# Altium schematic sheet Sky_Sheet.SchDoc: TotalSky
size A4; Author: Edwin Lima; CompanyName: Universidad de Cuenca; DrawnBy: Edwin Lima; SheetNumber: 1; SheetTotal: 5
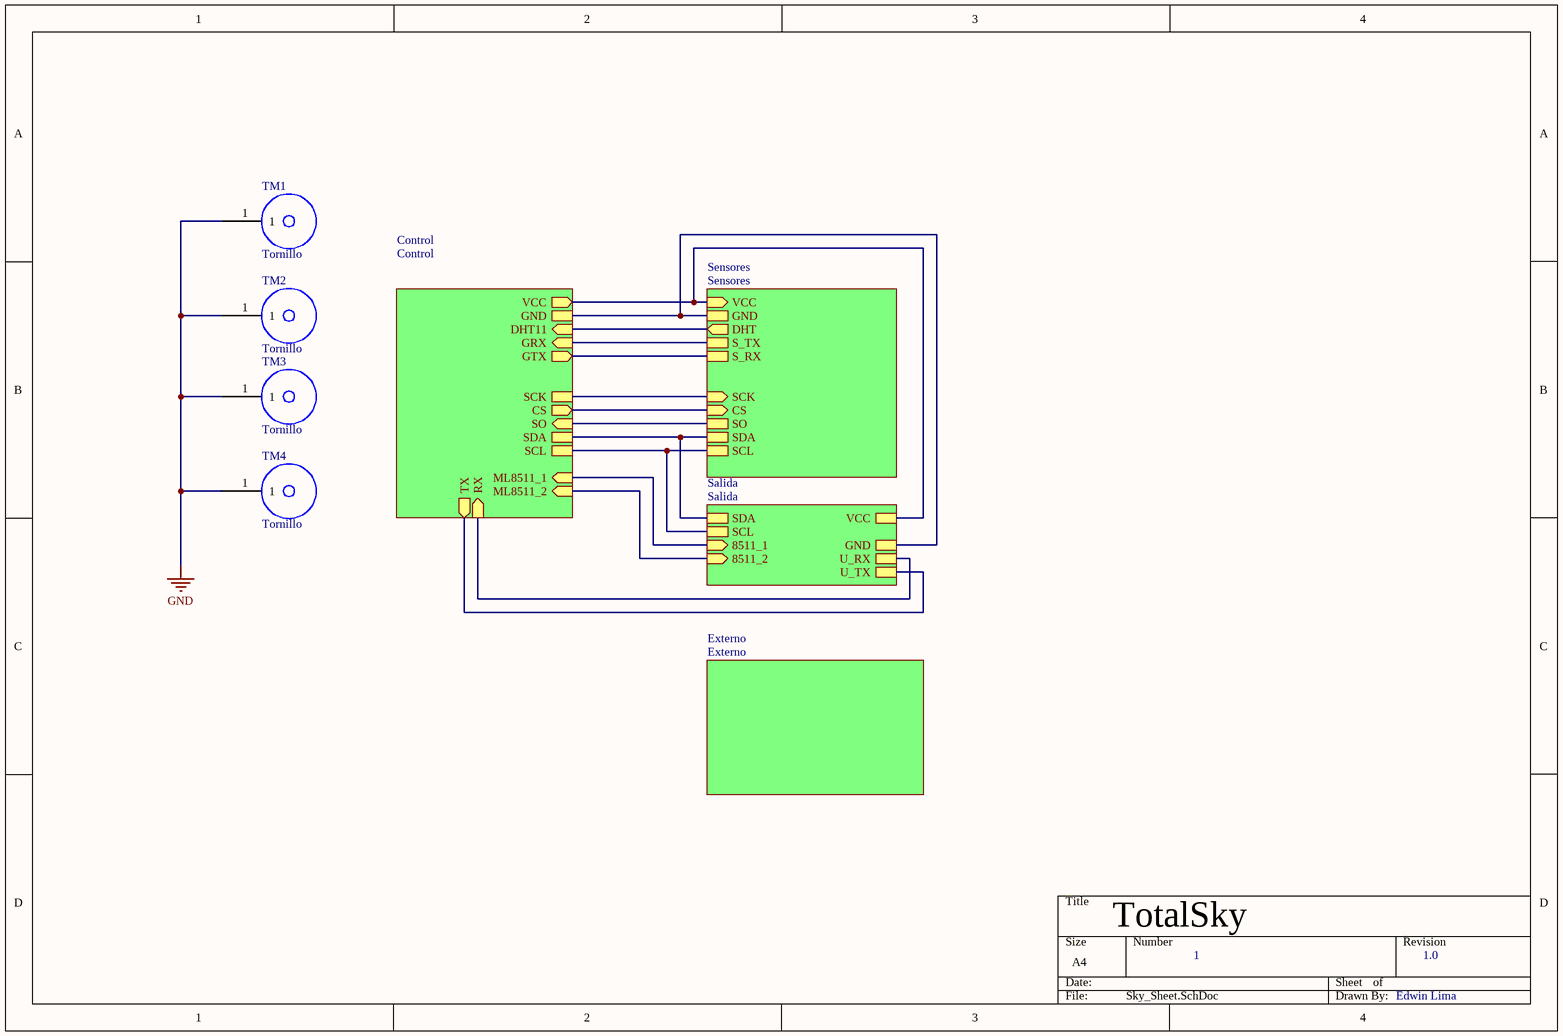
[diagram p0: Sky_Sheet.SchDoc]

## Parts
TM1  Tornillo  [Tornillo M3]
TM2  Tornillo  [Tornillo M3]
TM3  Tornillo  [Tornillo M3]
TM4  Tornillo  [Tornillo M3]

## Sub-sheets
Control = Control: DHT11 (in), ML8511_2 (in), SCL, ML8511_1 (in), VCC (out), RX (in), TX (out), SDA, GRX (in), GTX (out), SCK, CS (out), SO (in), GND
Externo = Externo: no entries
Salida = Salida: VCC, GND, SDA, SCL, 8511_1 (in), 8511_2 (in), U_RX, U_TX
Sensores = Sensores: VCC (in), GND, DHT (out), SCL, SDA, SCK (in), CS (in), SO, S_RX, S_TX

## Nets
GND: TM1.1 TM2.1 TM3.1 TM4.1
(unnamed): sheet Control/DHT11, sheet Sensores/DHT
(unnamed): sheet Control/ML8511_2, sheet Salida/8511_2
(unnamed): sheet Control/SCL, sheet Sensores/SCL, sheet Salida/SCL
(unnamed): sheet Control/ML8511_1, sheet Salida/8511_1
(unnamed): sheet Control/VCC, sheet Sensores/VCC, sheet Salida/VCC
(unnamed): sheet Control/RX, sheet Salida/U_RX
(unnamed): sheet Control/TX, sheet Salida/U_TX
(unnamed): sheet Control/SDA, sheet Sensores/SDA, sheet Salida/SDA
(unnamed): sheet Control/GRX, sheet Sensores/S_TX
(unnamed): sheet Control/GTX, sheet Sensores/S_RX
(unnamed): sheet Control/SCK, sheet Sensores/SCK
(unnamed): sheet Control/CS, sheet Sensores/CS
(unnamed): sheet Control/SO, sheet Sensores/SO
(unnamed): sheet Control/GND, sheet Sensores/GND, sheet Salida/GND

## Notes on the sheet
- 1
- 1.0